# EAGLE design module (EAGLE 9.2.2)
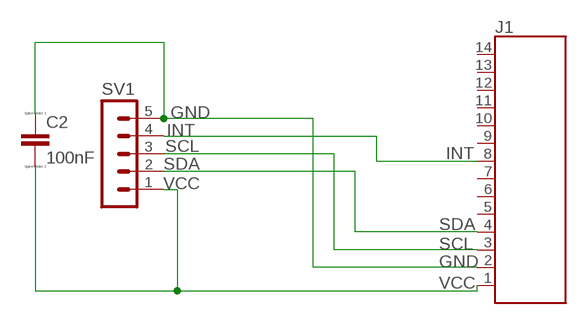
[diagram p0: schematic, sheet 1]

## Parts
C2  100nF  CC1206  [C1206]
J1  686114183522  [686114183522]
SV1  MA05-1  [MA05-1]

## Nets
GND: C2.1 J1.2 SV1.5
INT: J1.8 SV1.4
SCL: J1.3 SV1.3
SDA: J1.4 SV1.2
VCC: C2.2 J1.1 SV1.1
Unconnected: J1.5 J1.6 J1.7 J1.9 J1.10 J1.11 J1.12 J1.13 J1.14

## Library data of the parts
C2 = eagle-ltspice:C: CAPACITOR, European symbol; SPICEMODEL: NONE; SPICEPREFIX: C
J1 = Wurth_Elektronik_Electromechanic_FPC_Connectors_&_Flat_Flexible_Cable_rev18c:686114183522: 686114183522 WR-FPC 1.00mm SMT Horizontal Bottom Contact - Low Profile <http://katalog.we-online.de/media/images/v2/Family_WR-FPC_6861xx183522.jpg> Details see: http://katalog.we-online.de/en/em/FPC_1_00_SMT_ZIF_HORIZONTAL_BOTTOM_CONTACT_LOW_PROFILE_6861xx183522 Created by Yingchun,shan 2016 (C) Wurth Elektronik
SV1 = con-lstb:MA05-1: PIN HEADER; OC_FARNELL: unknown; OC_NEWARK: unknown

## Board
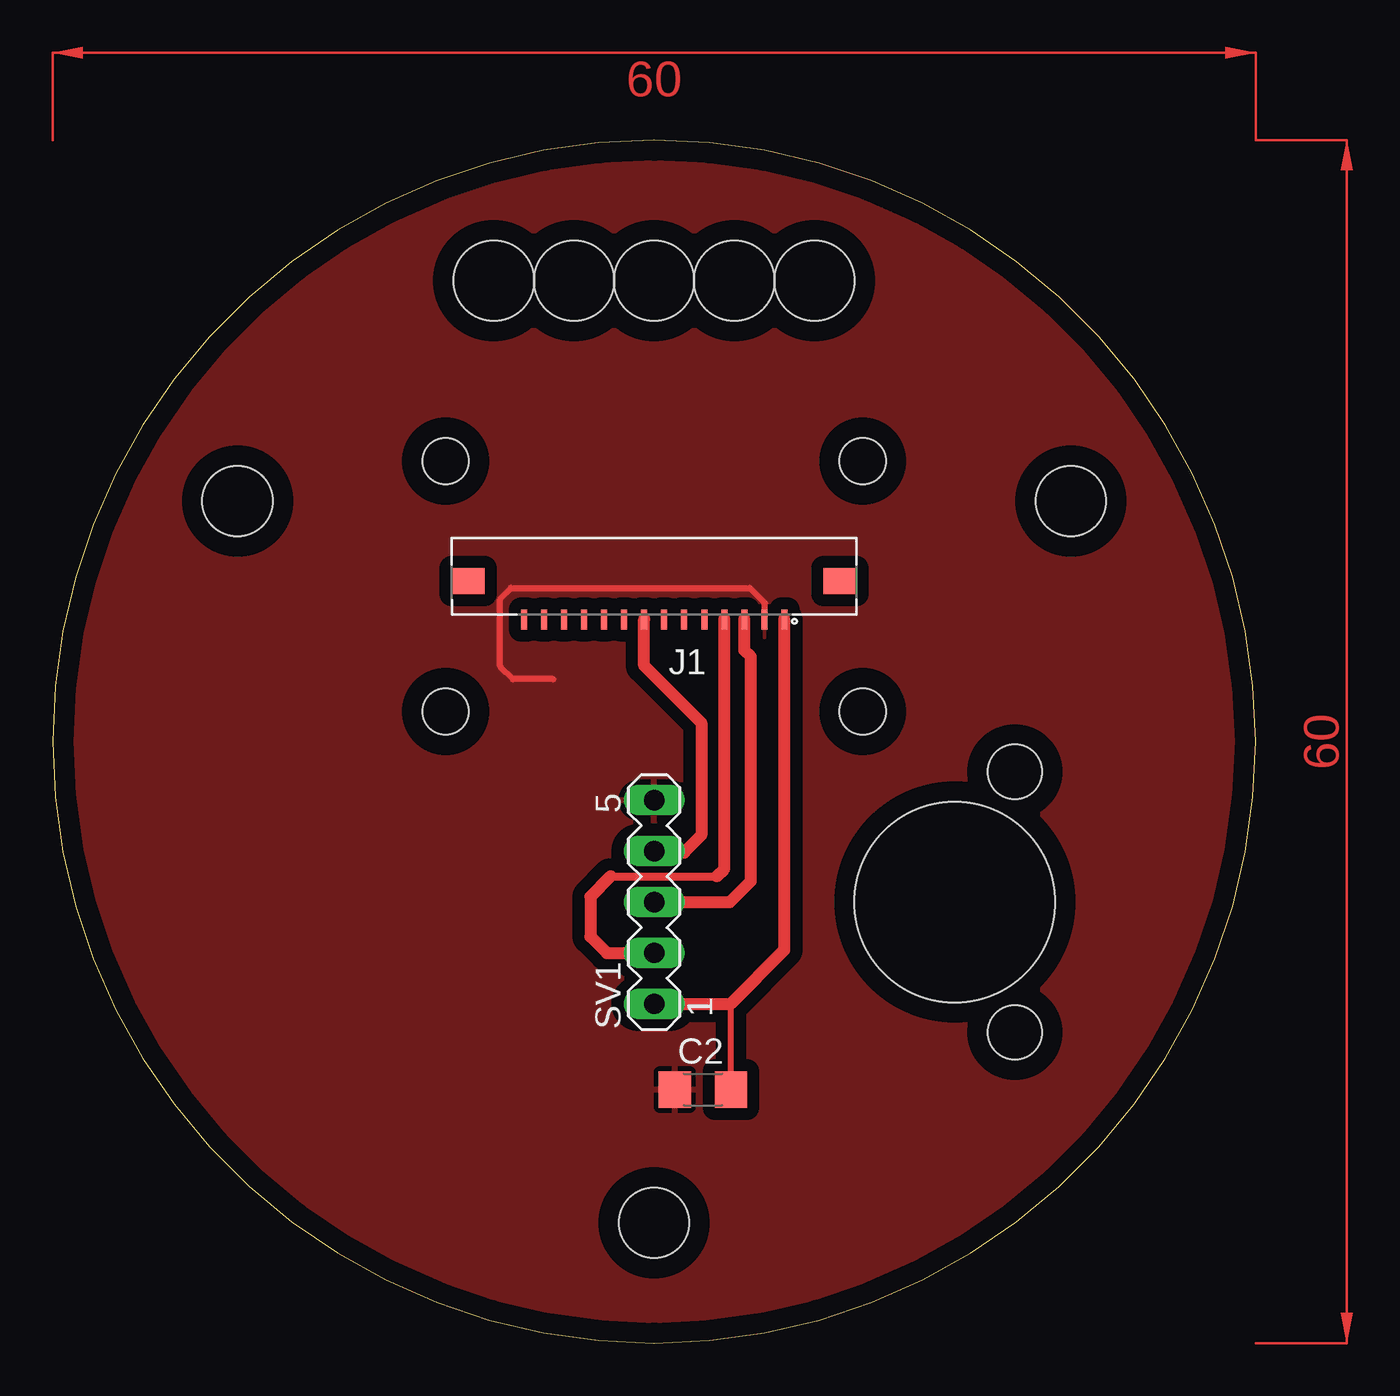
[diagram p1: board, top side]

Size 60 x 60 mm. Coordinates in mm from the lower left corner, seen from the top.
Outline: 0,30 arc90 30,0 arc90 60,30 arc90 30,60 arc90 0,30
Copper layers (1*16): Top 0.035mm / dielectric 1.5mm / Bottom 0.035mm
Design rules "default": minimum track width 6mil, minimum drill 0.35mm, track to track 6mil, track to pad 6mil, pad to pad 6mil, via to via 6mil, smd to smd 6mil, copper to edge 40mil, drill to drill 6mil, minimum pad ring 10mil, minimum via ring 8mil, stop-mask expansion 4mil, vias tented up to drill 0mil, thermal gap 10mil
Holes 2.7 mm at 48,28.5 48,15.5
Holes 10 mm at 45,22
Holes 3.5 mm at 30,6 50.78,42 9.22,42
Holes 4 mm at 30,53 34,53 38,53 26,53 22,53
Holes 2.3 mm at 19.6,44 40.4,44 19.6,31.5 40.4,31.5

### Footprints (pad centres in the part's own frame; a part is rotated, then mirrored left to right if it is on the bottom)
C1206 = smd 1.6 x 1.8: 1 -1.4,0; 2 1.4,0
686114183522 = smd 0.3 x 1: 1 -6.5,1.9; 2 -5.5,1.9; 3 -4.5,1.9; 4 -3.5,1.9; 5 -2.5,1.9; 6 -1.5,1.9; 7 -0.5,1.9; 8 0.5,1.9; 9 1.5,1.9; 10 2.5,1.9; 11 3.5,1.9; 12 4.5,1.9; 13 5.5,1.9; 14 6.5,1.9 | smd 1.65 x 1.3: Z1 -9.275,0; Z2 9.275,0
MA05-1 = drill 1.016 long: 1 -5.08,0; 2 -2.54,0; 3 0,0; 4 2.54,0; 5 5.08,0

### Placement (x,y rotation side)
C2  32.43,12.64 0 top
J1  30,38 180 top
SV1  30,22 90 top

### Tracks (layer width: path | path; a pad name or v marks a point on that pad's centre or on a via)
GND
  Top 0.305: 24.96,33.12 22.96,33.12 22.32,33.75 22.32,37.1 22.86,37.64 22.86,37.66 34.77,37.66 35.53,36.9 35.5,36.87 J1.2
  pour Top (isolate 0.61): 0.13,62.67 0.13,0.08 0.31,-0.1 58.2,-0.1 66.45,8.15 66.45,37.74 41.63,62.56
INT
  Top 0.305: 31.49,24.47 31.42,24.54
  Top 0.61: J1.8 29.5,33.79 32.36,30.93 32.36,25.34 31.49,24.47 | 31.42,24.54 SV1.4
SCL
  Top 0.61: J1.3 34.5,34.55 34.82,34.23 34.82,23.05 33.77,22 SV1.3
SDA
  Top 0.406: 27.84,23.28 33.12,23.28
  Top 0.61: 27.84,23.28 26.82,22.26 26.82,20.28 27.64,19.46 SV1.2 | J1.4 33.5,23.66 33.12,23.28
VCC
  Top 0.305: C2.2 33.82,16.92
  Top 0.61: SV1.1 33.82,16.92 36.5,19.6 J1.1
(copper drawn outside any net)
  shapes: Top area x2